# Altium schematic sheet Sheet1.SchDoc
size 431 x 279 mm; SheetNumber: 1; SheetTotal: 1; ENG_APP_DATE: --/--/--; DSN_APP_DATE: --/--/--; CHK_APP_DATE: --/--/--
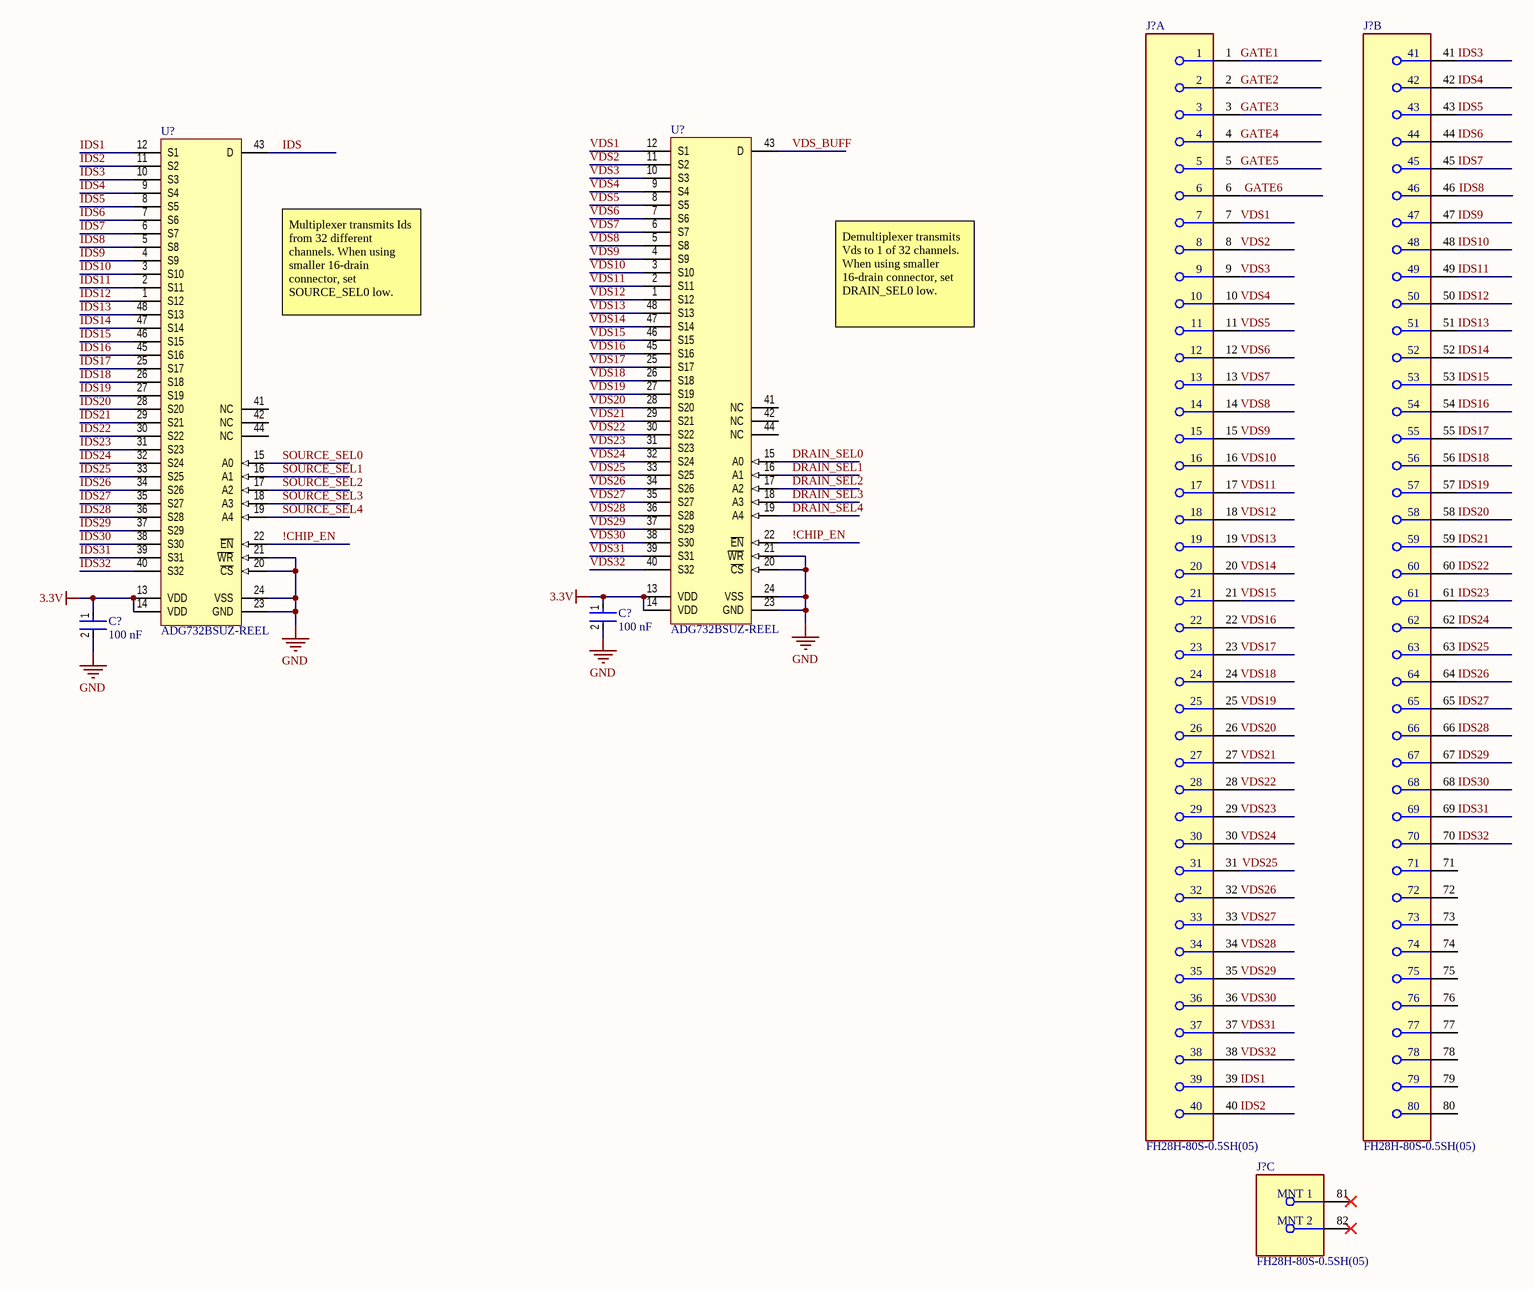
[diagram p0: Sheet1.SchDoc]

## Parts
(Parts that share a designator on the sheet are numbered #1, #2 ... from top to bottom, then left to right.)
C?#1  100 nF  [FP-C0805C-DN-MFG]
C?#2  100 nF  [FP-C0805C-DN-MFG]
J?#1  FH28H-80S-0.5SH(05)  [FP-FH28H-80S-0_5SH_05-MFG]  (part A of 3)
J?#2  FH28H-80S-0.5SH(05)  [FP-FH28H-80S-0_5SH_05-MFG]  (part B of 3)
J?#3  FH28H-80S-0.5SH(05)  [FP-FH28H-80S-0_5SH_05-MFG]  (part C of 3)
U?#1  ADG732BSUZ-REEL  [ADI-SU-48_N]
U?#2  ADG732BSUZ-REEL  [ADI-SU-48_N]

## Nets
3.3V: C?#1.1 C?#2.1 U?#1.13(VDD) U?#1.14(VDD) U?#2.13(VDD) U?#2.14(VDD)
GND: C?#1.2 C?#2.2 U?#1.20(~{CS}) U?#1.21(~{WR}) U?#1.23(GND) U?#1.24(VSS) U?#2.20(~{CS}) U?#2.21(~{WR}) U?#2.23(GND) U?#2.24(VSS)
!CHIP_EN: U?#1.22(~{EN}) U?#2.22(~{EN})
DRAIN_SEL0: U?#2.15(A0)
DRAIN_SEL1: U?#2.16(A1)
DRAIN_SEL2: U?#2.17(A2)
DRAIN_SEL3: U?#2.18(A3)
DRAIN_SEL4: U?#2.19(A4)
GATE1: J?#1.1
GATE2: J?#1.2
GATE3: J?#1.3
GATE4: J?#1.4
GATE5: J?#1.5
GATE6: J?#1.6
IDS: U?#1.43(D)
IDS1: J?#1.39 U?#1.12(S1)
IDS2: J?#1.40 U?#1.11(S2)
IDS3: J?#2.41 U?#1.10(S3)
IDS4: J?#2.42 U?#1.9(S4)
IDS5: J?#2.43 U?#1.8(S5)
IDS6: J?#2.44 U?#1.7(S6)
IDS7: J?#2.45 U?#1.6(S7)
IDS8: J?#2.46 U?#1.5(S8)
IDS9: J?#2.47 U?#1.4(S9)
IDS10: J?#2.48 U?#1.3(S10)
IDS11: J?#2.49 U?#1.2(S11)
IDS12: J?#2.50 U?#1.1(S12)
IDS13: J?#2.51 U?#1.48(S13)
IDS14: J?#2.52 U?#1.47(S14)
IDS15: J?#2.53 U?#1.46(S15)
IDS16: J?#2.54 U?#1.45(S16)
IDS17: J?#2.55 U?#1.25(S17)
IDS18: J?#2.56 U?#1.26(S18)
IDS19: J?#2.57 U?#1.27(S19)
IDS20: J?#2.58 U?#1.28(S20)
IDS21: J?#2.59 U?#1.29(S21)
IDS22: J?#2.60 U?#1.30(S22)
IDS23: J?#2.61 U?#1.31(S23)
IDS24: J?#2.62 U?#1.32(S24)
IDS25: J?#2.63 U?#1.33(S25)
IDS26: J?#2.64 U?#1.34(S26)
IDS27: J?#2.65 U?#1.35(S27)
IDS28: J?#2.66 U?#1.36(S28)
IDS29: J?#2.67 U?#1.37(S29)
IDS30: J?#2.68 U?#1.38(S30)
IDS31: J?#2.69 U?#1.39(S31)
IDS32: J?#2.70 U?#1.40(S32)
SOURCE_SEL0: U?#1.15(A0)
SOURCE_SEL1: U?#1.16(A1)
SOURCE_SEL2: U?#1.17(A2)
SOURCE_SEL3: U?#1.18(A3)
SOURCE_SEL4: U?#1.19(A4)
VDS1: J?#1.7 U?#2.12(S1)
VDS2: J?#1.8 U?#2.11(S2)
VDS3: J?#1.9 U?#2.10(S3)
VDS4: J?#1.10 U?#2.9(S4)
VDS5: J?#1.11 U?#2.8(S5)
VDS6: J?#1.12 U?#2.7(S6)
VDS7: J?#1.13 U?#2.6(S7)
VDS8: J?#1.14 U?#2.5(S8)
VDS9: J?#1.15 U?#2.4(S9)
VDS10: J?#1.16 U?#2.3(S10)
VDS11: J?#1.17 U?#2.2(S11)
VDS12: J?#1.18 U?#2.1(S12)
VDS13: J?#1.19 U?#2.48(S13)
VDS14: J?#1.20 U?#2.47(S14)
VDS15: J?#1.21 U?#2.46(S15)
VDS16: J?#1.22 U?#2.45(S16)
VDS17: J?#1.23 U?#2.25(S17)
VDS18: J?#1.24 U?#2.26(S18)
VDS19: J?#1.25 U?#2.27(S19)
VDS20: J?#1.26 U?#2.28(S20)
VDS21: J?#1.27 U?#2.29(S21)
VDS22: J?#1.28 U?#2.30(S22)
VDS23: J?#1.29 U?#2.31(S23)
VDS24: J?#1.30 U?#2.32(S24)
VDS25: J?#1.31 U?#2.33(S25)
VDS26: J?#1.32 U?#2.34(S26)
VDS27: J?#1.33 U?#2.35(S27)
VDS28: J?#1.34 U?#2.36(S28)
VDS29: J?#1.35 U?#2.37(S29)
VDS30: J?#1.36 U?#2.38(S30)
VDS31: J?#1.37 U?#2.39(S31)
VDS32: J?#1.38 U?#2.40(S32)
VDS_BUFF: U?#2.43(D)

Not connected (* = marked no-connect by the designer): J?#2 71 72 73 74 75 76 77 78 79 80; J?#3 81(MNT_1)* 82(MNT_2)*; U?#1 41(NC) 42(NC) 44(NC); U?#2 41(NC) 42(NC) 44(NC)

## Notes on the sheet
- (near U?#1) Multiplexer transmits Ids from 32 different channels. When using smaller 16-drain connector, set SOURCE_SEL0 low.
- Demultiplexer transmits Vds to 1 of 32 channels. When using smaller 16-drain connector, set DRAIN_SEL0 low.
- 8
- 7
- 6
- 5
- 4
- 3
- DWG. NO.
- REV.
- SHT.
- 2
- 1
- THIS DOCUMENT AND THE DATA DISCLOSED HEREIN OR HEREWITH IS THE PROPERTY OF ALTIUM LIMITED AND MAY BE FREELY DISTRIBUTED IN WHOLE. NO RIGHTS ARE RESERVED OR EXPRESS OR IMPLIED WARANTEE GIVEN.
- REVISION
- DESCRIPTION
- DATE
- APPROVED
- F
- E
- D
- C
- B
- ENG:
- APPROVALS
- PROJECT
- SUITE 200
- 2175 SALK AVENUE
- CARLSBAD, CA 92008
- A
- DSN:
- CHK:
- REFERENCE DOCUMENTS
- PROJECT REVISION:
- TITLE
- DOCUMENT REVISION:
- DESIGN ITEM:
- USA
- BOM:
- FAB DWG:
- PCB DWG:
- ASSY DWG:
- SCALE:
- SIZE
- CAGE CODE
- FILE NAME
- DWG NO.
- SHEET
- OF
- REV

## Library data of the parts
C?#1 C?#2 = CMP-2007-00279-2: CAP CER 0.1UF 50V X7R 0805; Manufacturer Part Number: C0805C104K5RACTU; Manufacturer: KEMET; Value: 0.10 μF; Tolerance: 0.1; Temperature Coefficient: 30ppm/°C; Material: Ceramic; Device Class L2: Capacitors; Temperature Range Low: -55°C; Voltage Rating: 50 V; Digikey Description: CAP CER 0.1UF 50V X7R 0805; Category: Cap; ComponentLink2Description: Datasheet; Octopart: https://octopart.com/c0805c104k5ractu-kemet-143926; RoHS: TRUE; ComponentLink2URL: https://content.kemet.com/datasheets/KEM_C1003_C0G_SMD.pdf; Temperature Characteristic: X7R; Temperature: -55°C to +125°C; Height: 0.88mm; Temperature Range High: +125°C; Device Class L1: Passive Components; Automotive: No; Lead Free: Yes; Ipc Land Pattern Name: CAPC200125X78; Device Class L3: Ceramic Capacitors; Mouser Description: Cap Ceramic 0.1uF 50V X7R 10% SMD 2.0 x 1.2 mm 125 C Paper T/R; Capacitance: 0.10 μF; Package: C0805C-DN
J?#1-J?#3 = CMP-11609-000031-1: CONN FFC BOTTOM 80POS 0.50MM R/A; Number of Positions: 80; Voltage Rating: 50V; Contact Resistance: 50mR; Max Current Rating: 500mA; Gender: Receptacle; Pitch: 0.5mm; Mating Cycles: 20; Actuator Material: Polymer; Insulation Resistance: 500MR; Contact Plating: Gold; Orientation: Right Angle; Contact Material: Bronze; Number of Rows: 1; Max Operating Temperature: 85°C; Number of Contacts: 80; Flammability Rating: UL94 V-0; Lead Pitch: 0.5mm; Length: 44.9mm; Radiation Hardening: No; Packaging: Tape and Reel; RoHS Compliant: Yes; REACH SVHC: No SVHC; Current Rating: 500mA; Housing Color: Grey; Depth: 6.5mm; Min Operating Temperature: -40°C; Series: FH28; Termination: Solder; Package Quantity: 1; Housing Material: Polymer; Mount: Surface Mount; Max Voltage Rating (AC): 50V
U?#1 U?#2 = CMP-0798-00236-1: 1.8 to 5.5 V / +/-2.5 V, 4 Ohm, 32-Channel Analog Multiplexer, -40 to 85 degC, 48-pin QFP (SU-48), Reel; Manufacturer: Analog Devices; Ron (ohms): 4; Max Analog Signal Range: Vss to Vdd; Bandwidth (Hz): 18M; Supply V Guar Performance: Dual_(+/-2.5V), Single_(+3V), Single_(+5V); t transition (s): 23n; PackageReference: SU-48; ComponentLink3URL: http://www.analog.com/static/imported-files/packages/470644706845302410119987SU48_7x7.pdf; PartNumber: ADG732BSUZ-REEL; ComponentLink1URL: http://www.analog.com/en/index.html; Mounting Technology: Surface Mount; ComponentLink2Description: Datasheet; Packing: Reel; ComponentLink1Description: Manufacturer URL; DatasheetVersion: Rev. 0; ComponentLink2URL: http://www.analog.com/static/imported-files/data_sheets/ADG726_732.pdf; PackageDescription: 48-Pin Thin Plastic Quad Flat Package, Body 7 x 7 mm, Pitch 0.5 mm; Code_JEDEC: MS-026ABC; ComponentLink3Description: Package Specification